# EAGLE board avocado-rev01 (EAGLE 9.4.0)
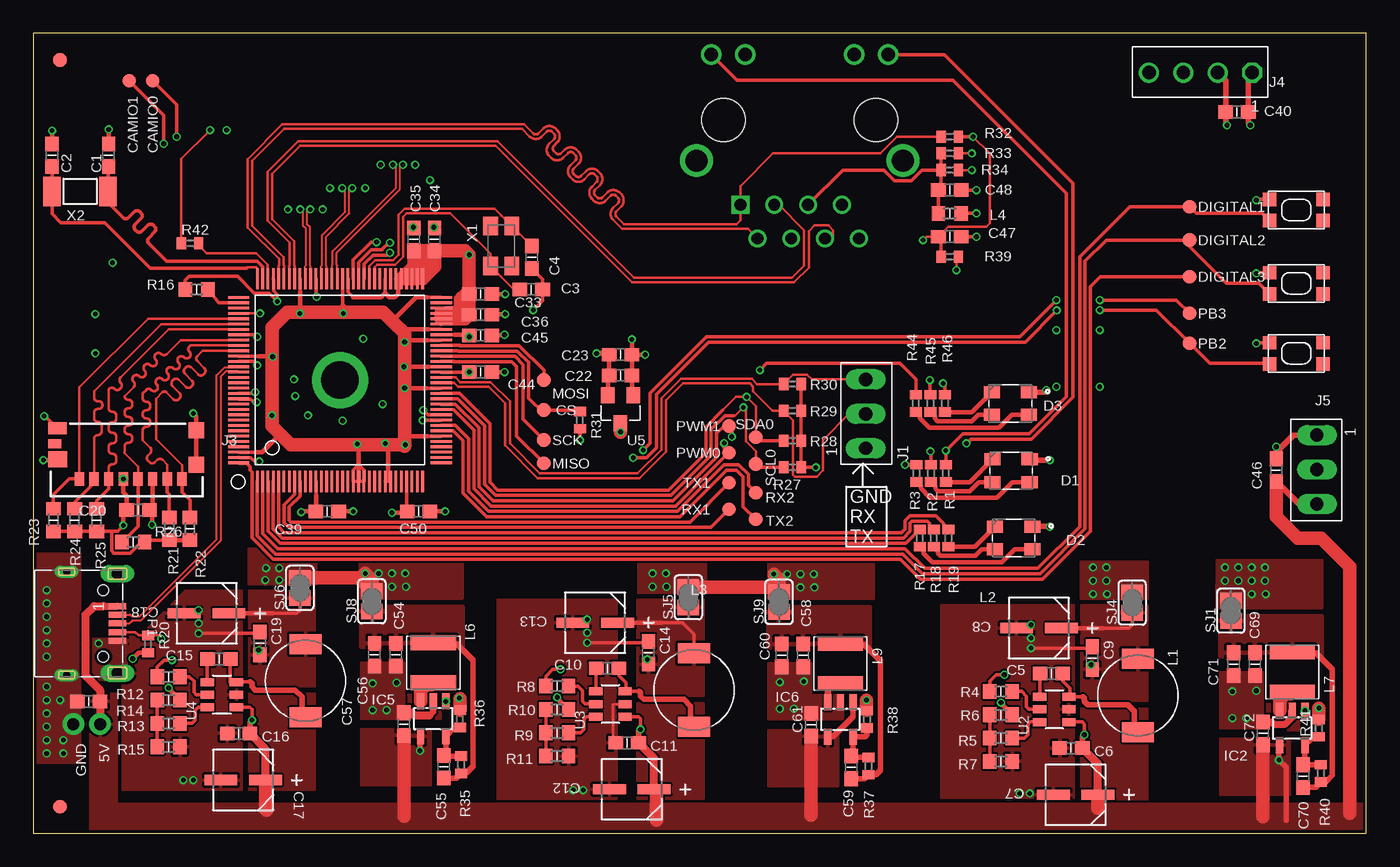
[diagram p5: board, top side]
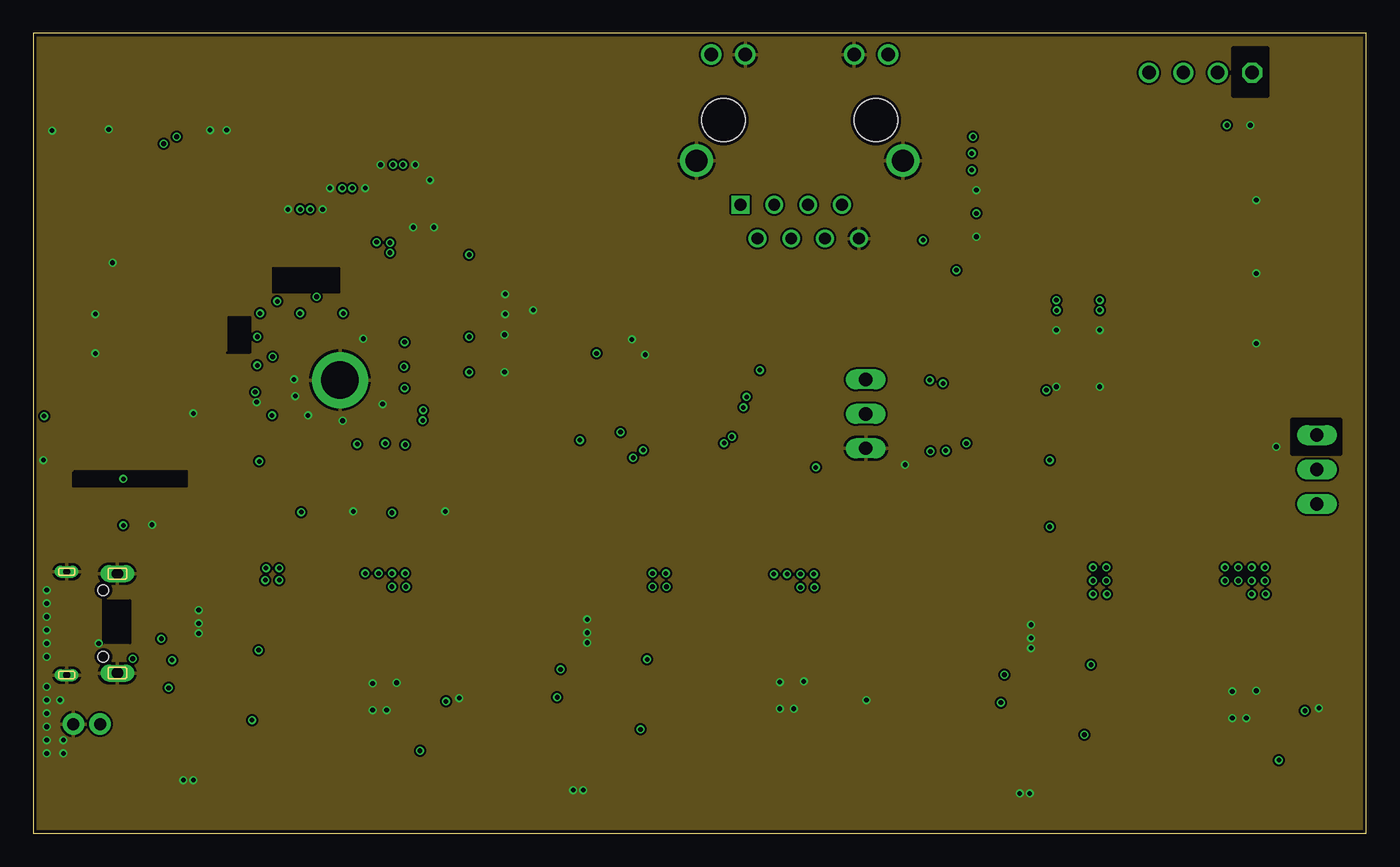
[diagram p6: board, inner layer GND]
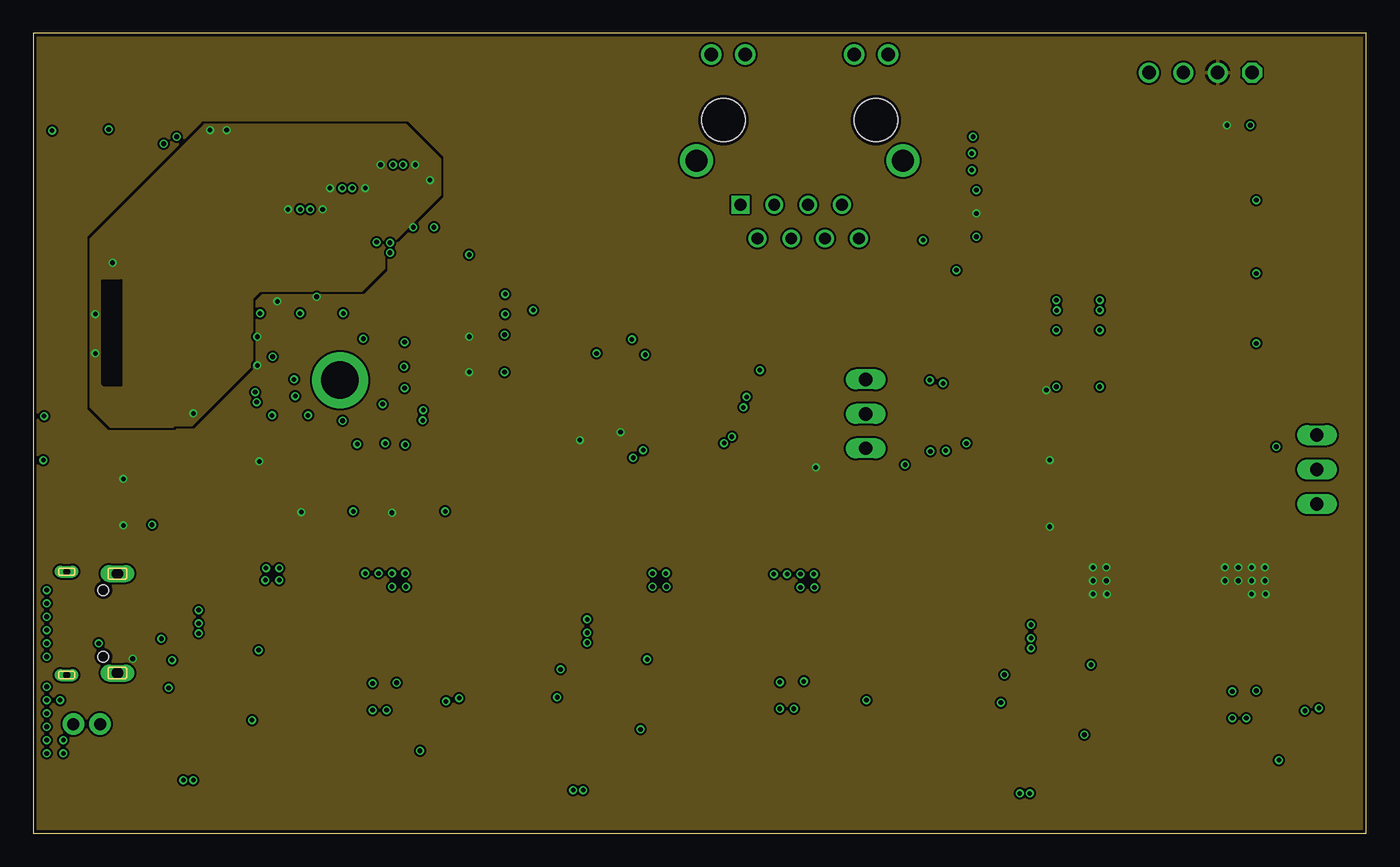
[diagram p7: board, inner layer 3V3]
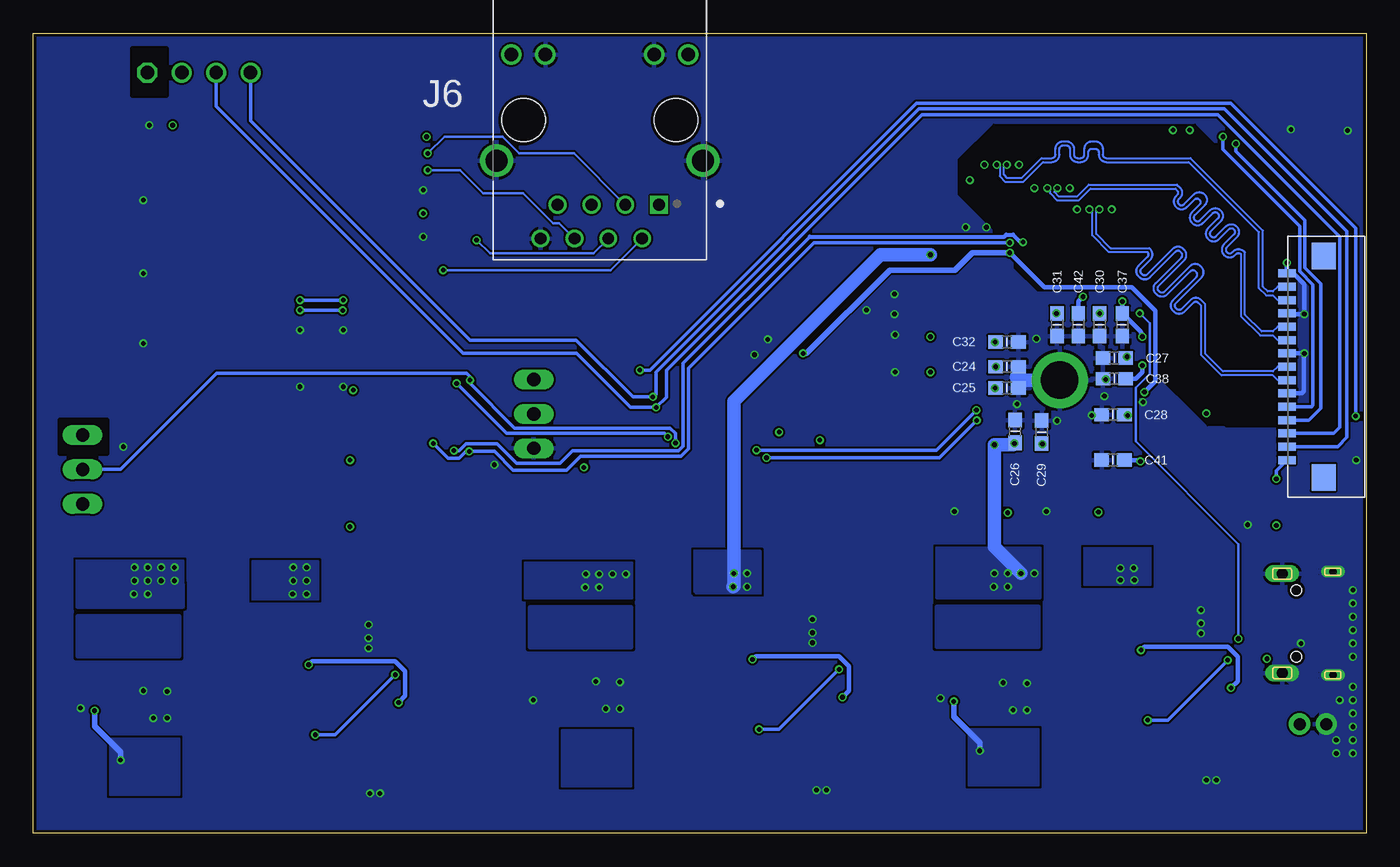
[diagram p8: board, bottom side, seen from below]

Size 100 x 60 mm. Coordinates in mm from the lower left corner, seen from the top.
Outline: 0,0 100,0 100,60 0,60 0,0
Copper layers (1+2*3+16): Top 0.018mm / dielectric 0.36mm / GND 0.035mm / dielectric 0.71mm / 3V3 0.035mm / dielectric 0.36mm / Bottom 0.018mm
Design rules "eC_4Layer_PClass6_BaseCopperO18-I35_eCDefault": minimum track width 0.15mm, minimum drill 0.35mm, track to track 0.15mm, track to pad 0.15mm, pad to pad 0.15mm, via to via 0.15mm, smd to smd 0mil, copper to edge 0.25mm, drill to drill 0.35mm, minimum pad ring 0.175mm, minimum via ring 0.125mm, stop-mask expansion 0mil, vias tented up to drill 0.45mm, thermal gap 0.2mm
Net classes: 0 default: width 0.2 mm, drill 0.35 mm, clearance 0.15 mm; 1 MIPI: width 0.15 mm, drill 0.35 mm, clearance 0.1 mm; 3 power: width 0.25 mm, drill 0.35 mm, clearance 0.15 mm

## Footprints (pad centres in the part's own frame; a part is rotated, then mirrored left to right if it is on the bottom)
PAD = drill 0.9 pad 1.6: P$1 0,0
C0603 = smd 1.1 x 1: 1 -0.85,0; 2 0.85,0
CAP4.3X6.1 = smd 2.464 x 0.762: 1 -1.676,0; 2 1.676,0
TEST_TESTPOINT = smd 1 x 1: 1 0,0
LED_LL-R3528RGBC-008-B = smd 1.2 x 0.9: 1 -1.4,-0.85; 2 1.4,-0.85; 3 1.4,0.85; 4 -1.4,0.85
FIDUCIAL_1MM = smd 1 x 1: 1 0,0
SOT23-5L = smd 0.55 x 1.2: 1 -0.95,-1.3; 2 0,-1.3; 3 0.95,-1.3; 4 0.95,1.3; 5 -0.95,1.3
HEADER-3 = drill 1 long: 1 -2.62,0.048; 2 -0.04,0.048; 3 2.54,0.048
MOLEX_0475710001 = smd 0.7 x 1: 1 3.55,1.415; 2 2.45,1.415; 3 1.35,1.415; 4 0.25,1.415; 5 -0.85,1.415; 6 -1.95,1.415; 7 -3.05,1.415; 8 -4.15,1.415 | smd 1.15 x 1.2: 9 -5.225,0.365; 10 -5.225,-2.225 | smd 1.4 x 0.9: 11 5.2,-2.375 | smd 1 x 0.7: 12 5.4,-1.225 | smd 1.45 x 1.2: 13 5.175,-0.075
HEADER-4 = drill 1 octagon: 1 -3.89,0.048 | drill 1: 2 -1.31,0.048; 3 1.27,0.048; 4 3.85,0.048
HANRUN_HR911105A = drill 0.89 square: 1 4.45,-6.35 | drill 0.89: 2 3.18,-8.89; 3 1.91,-6.35; 4 0.64,-8.89; 5 -0.63,-6.35; 6 -1.9,-8.89; 7 -3.17,-6.35; 8 -4.44,-8.89 | drill 1.02: 9 6.625,4.9; 10 4.085,4.9; 11 -4.085,4.9; 12 -6.625,4.9 | drill 1.63: 15 7.745,-3.05; 16 -7.745,-3.05 | hole 3.25: -5.715,0; 5.715,0
B82462A4153K = smd 1.5 x 2.4: P$1 -2.75,0; P$2 2.75,0
R0603 = smd 1 x 1.1: 1 -0.85,0; 2 0.85,0
ASPI-4030S-253675 = smd 1.1 x 3.4: P$1 -1.5,0; P$2 1.5,0
629105150521 = smd 0.45 x 1.3: 1 -1.3,1.05; 2 -0.65,1.05; 3 0,1.05; 4 0.65,1.05; 5 1.3,1.05 | drill 0.85 pad 1.2 long: SHELL -3.725,1.05; SHELL1 3.725,1.05 | drill 0.55 pad 0.9 long: SHELL2 -3.875,-2.75; SHELL3 3.875,-2.75 | hole 0.8: -2.5,0; 2.5,0
686115148922 = smd 0.6 x 1.3: 1 7,2.95; 2 6,2.95; 3 5,2.95; 4 4,2.95; 5 3,2.95; 6 2,2.95; 7 1,2.95; 8 0,2.95; 9 -1,2.95; 10 -2,2.95; 11 -3,2.95; 12 -4,2.95; 13 -5,2.95; 14 -6,2.95; 15 -7,2.95 | smd 2 x 1.8: SHLD1 -8.3,0.2; SHLD2 8.3,0.2
R0402 = smd 0.7 x 0.9: 1 -0.65,0; 2 0.65,0
SJ = smd 1.168 x 1.6: 1 -0.762,0; 2 0.762,0
KMR2 = smd 1 x 1: 1 2,0.8; 2 2,-0.8; 3 -2,0.8; 4 -2,-0.8
QFP-128 = smd 0.2 x 1.6: 1 -6.2,-7.6; 2 -5.8,-7.6; 3 -5.4,-7.6; 4 -5,-7.6; 5 -4.6,-7.6; 6 -4.2,-7.6; 7 -3.8,-7.6; 8 -3.4,-7.6; 9 -3,-7.6; 10 -2.6,-7.6; 11 -2.2,-7.6; 12 -1.8,-7.6; 13 -1.4,-7.6; 14 -1,-7.6; 15 -0.6,-7.6; 16 -0.2,-7.6; 17 0.2,-7.6; 18 0.6,-7.6; 19 1,-7.6; 20 1.4,-7.6; 21 1.8,-7.6; 22 2.2,-7.6; 23 2.6,-7.6; 24 3,-7.6; 25 3.4,-7.6; 26 3.8,-7.6; 27 4.2,-7.6; 28 4.6,-7.6; 29 5,-7.6; 30 5.4,-7.6; 31 5.8,-7.6; 32 6.2,-7.6; 65 6.2,7.6; 66 5.8,7.6; 67 5.4,7.6; 68 5,7.6; 69 4.6,7.6; 70 4.2,7.6; 71 3.8,7.6; 72 3.4,7.6; 73 3,7.6; 74 2.6,7.6; 75 2.2,7.6; 76 1.8,7.6; 77 1.4,7.6; 78 1,7.6; 79 0.6,7.6; 80 0.2,7.6; 81 -0.2,7.6; 82 -0.6,7.6; 83 -1,7.6; 84 -1.4,7.6; 85 -1.8,7.6; 86 -2.2,7.6; 87 -2.6,7.6; 88 -3,7.6; 89 -3.4,7.6; 90 -3.8,7.6; 91 -4.2,7.6; 92 -4.6,7.6; 93 -5,7.6; 94 -5.4,7.6; 95 -5.8,7.6; 96 -6.2,7.6 | smd 1.6 x 0.2: 33 7.6,-6.2; 34 7.6,-5.8; 35 7.6,-5.4; 36 7.6,-5; 37 7.6,-4.6; 38 7.6,-4.2; 39 7.6,-3.8; 40 7.6,-3.4; 41 7.6,-3; 42 7.6,-2.6; 43 7.6,-2.2; 44 7.6,-1.8; 45 7.6,-1.4; 46 7.6,-1; 47 7.6,-0.6; 48 7.6,-0.2; 49 7.6,0.2; 50 7.6,0.6; 51 7.6,1; 52 7.6,1.4; 53 7.6,1.8; 54 7.6,2.2; 55 7.6,2.6; 56 7.6,3; 57 7.6,3.4; 58 7.6,3.8; 59 7.6,4.2; 60 7.6,4.6; 61 7.6,5; 62 7.6,5.4; 63 7.6,5.8; 64 7.6,6.2; 97 -7.6,6.2; 98 -7.6,5.8; 99 -7.6,5.4; 100 -7.6,5; 101 -7.6,4.6; 102 -7.6,4.2; 103 -7.6,3.8; 104 -7.6,3.4; 105 -7.6,3; 106 -7.6,2.6; 107 -7.6,2.2; 108 -7.6,1.8; 109 -7.6,1.4; 110 -7.6,1; 111 -7.6,0.6; 112 -7.6,0.2; 113 -7.6,-0.2; 114 -7.6,-0.6; 115 -7.6,-1; 116 -7.6,-1.4; 117 -7.6,-1.8; 118 -7.6,-2.2; 119 -7.6,-2.6; 120 -7.6,-3; 121 -7.6,-3.4; 122 -7.6,-3.8; 123 -7.6,-4.2; 124 -7.6,-4.6; 125 -7.6,-5; 126 -7.6,-5.4; 127 -7.6,-5.8; 128 -7.6,-6.2 | drill 2.8: P$1 0,0
TSOT26 = smd 0.6 x 1: 1 -0.95,-1.099; 2 0,-1.099; 3 0.95,-1.099; 4 0.95,1.099; 5 0,1.099; 6 -0.95,1.099
SOT-23 = smd 1.016 x 1.2: 1 -0.95,-1.06; 2 0.95,-1.06; 3 0,1.06
3.2X2-4 = smd 1.4 x 1.1: P$1 -1.5,0.8; P$2 1.5,0.8; P$3 1.5,-0.8; P$4 -1.5,-0.8
XTAL-5X1.9 = smd 1.3 x 2.2: P$1 -2.1,0; P$2 2.1,0

## Placement (x,y rotation side)
5V  PADTH  [PAD]  5,8.2 180 top
C1  [C0603]  5.65,50.85 90 top
C2  [C0603]  1.4,50.85 90 top
C3  [C0603]  37.35,40.8 0 top
C4  [C0603]  37.4,43.2 270 top
C5  1u  [C0603]  76.38,11.98 0 top
C6  100n  [C0603]  77.85,6.39 180 top
C7  22u  [CAP4.3X6.1]  78.2,2.9 180 top
C8  22u  [CAP4.3X6.1]  75.45,15.4 180 top
C9  100n  [C0603]  79.45,13.15 90 top
C10  1u  [C0603]  43.08,12.38 0 top
C11  100n  [C0603]  44.55,6.79 180 top
C12  22u  [CAP4.3X6.1]  44.9,3.3 180 top
C13  22u  [CAP4.3X6.1]  42.15,15.8 180 top
C14  100n  [C0603]  46.15,13.55 90 top
C15  1u  [C0603]  13.93,13.08 0 top
C16  100n  [C0603]  15.4,7.49 180 top
C17  22u  [CAP4.3X6.1]  15.75,4 180 top
C18  22u  [CAP4.3X6.1]  13,16.5 180 top
C19  100n  [C0603]  17,14.25 90 top
C20  10u  [C0603]  7.85,24.25 0 top
C21  10u  [C0603]  4.15,9.9 180 top
C22  10u  [C0603]  44.05,34.35 0 top
C23  10u  [C0603]  44.05,35.9 0 top
C24  10u  [C0603]  26.95,35 0 bottom
C25  10u  [C0603]  26.95,33.4 0 bottom
C26  10u  [C0603]  26.35,30.15 90 bottom
C27  10u  [C0603]  18.9,35.65 180 bottom
C28  10u  [C0603]  19,31.4 180 bottom
C29  10u  [C0603]  24.35,30.1 90 bottom
C30  10u  [C0603]  20,38.15 270 bottom
C31  10u  [C0603]  23.2,38.15 270 bottom
C32  10u  [C0603]  26.95,36.85 0 bottom
C33  10u  [C0603]  33.55,40.45 0 top
C34  10u  [C0603]  30.1,44.55 90 top
C35  10u  [C0603]  28.55,44.55 90 top
C36  10u  [C0603]  33.55,38.9 0 top
C37  10u  [C0603]  18.3,38.15 270 bottom
C38  10u  [C0603]  18.9,34.1 180 bottom
C39  10u  [C0603]  22.05,24.15 0 top
C40  10u  [C0603]  90.3,54.1 180 top
C41  10u  [C0603]  19,28 180 bottom
C42  10u  [C0603]  21.6,38.15 270 bottom
C44  10u  [C0603]  33.55,34.6 0 top
C45  10u  [C0603]  33.55,37.35 0 top
C46  10u  [C0603]  93.25,27.25 270 top
C47  10u  [C0603]  68.75,44.75 0 top
C48  10u  [C0603]  68.75,48.25 0 top
C50  10u  [C0603]  28.9,24.15 0 top
C54  4u7  [C0603]  27.2,13.4 90 top
C55  47p  [C0603]  30.8,5 270 top
C56  10u  [C0603]  25.6,13.4 90 top
C57  10u  [C0603]  27.8,8.2 90 top
C58  4u7  [C0603]  57.75,13.35 90 top
C59  47p  [C0603]  61.35,4.95 270 top
C60  10u  [C0603]  56.15,13.35 90 top
C61  10u  [C0603]  58.35,8.15 90 top
C69  4u7  [C0603]  91.65,12.7 90 top
C70  47p  [C0603]  95.25,4.3 270 top
C71  10u  [C0603]  90.05,12.7 90 top
C72  10u  [C0603]  92.25,7.5 90 top
CAMIO0  TEST_TESTPOINT  [TEST_TESTPOINT]  8.95,56.45 270 top
CAMIO1  TEST_TESTPOINT  [TEST_TESTPOINT]  7.2,56.45 270 top
CS  TEST_TESTPOINT  [TEST_TESTPOINT]  38.3,31.75 0 top
D1  LL-R3528RGBC-008-B  [LED_LL-R3528RGBC-008-B]  73.35,27.2 180 top
D2  LL-R3528RGBC-008-B  [LED_LL-R3528RGBC-008-B]  73.55,22.15 180 top
D3  LL-R3528RGBC-008-B  [LED_LL-R3528RGBC-008-B]  73.3,32.25 180 top
DIGITAL1  TEST_TESTPOINT  [TEST_TESTPOINT]  86.75,47 0 top
DIGITAL2  TEST_TESTPOINT  [TEST_TESTPOINT]  86.75,44.5 0 top
DIGITAL3  TEST_TESTPOINT  [TEST_TESTPOINT]  86.75,41.75 0 top
FID1  FIDUCIAL  [FIDUCIAL_1MM]  2,58 0 top
FID2  FIDUCIAL  [FIDUCIAL_1MM]  2,2 0 top
GND  PADTH  [PAD]  3,8.2 180 top
IC2  3V#  [SOT23-5L]  94.45,7.9 180 top
IC5  3V#  [SOT23-5L]  30,8.6 180 top
IC6  [SOT23-5L]  60.55,8.55 180 top
J1  CONNECTOR-3HEADER3  [HEADER-3]  62.5,31.5 90 top
J3  0475710001  [MOLEX_0475710001]  7,28 180 top
J4  CONNECTOR-4HEADER4  [HEADER-4]  87.55,57.1 180 top
J5  CONNECTOR-3HEADER3  [HEADER-3]  96.25,27.25 270 top
J6  HR911105A  [HANRUN_HR911105A]  57.5,53.5 0 bottom
L1  CALC  [B82462A4153K]  82.87,10.34 90 top
L2  CALC  [B82462A4153K]  49.57,10.74 90 top
L3  CALC  [B82462A4153K]  20.42,11.44 90 top
L4  10uH(NC)  [R0603]  68.75,46.5 180 top
L6  2.2uH-DCR<0.1R-1.5A  [ASPI-4030S-253675]  30,12.8 90 top
L7  2.2uH-DCR<0.1R-1.5A  [ASPI-4030S-253675]  94.45,12.1 90 top
L9  2.2uH-DCR<0.1R-1.5A  [ASPI-4030S-253675]  60.55,12.75 90 top
MISO  TEST_TESTPOINT  [TEST_TESTPOINT]  38.3,27.75 0 top
MOSI  TEST_TESTPOINT  [TEST_TESTPOINT]  38.3,34 0 top
P1  USB629105150521  [629105150521]  5.25,15.75 270 top
P2  CONNECTOR-15686115148922  [686115148922]  3,35 90 bottom
PB2  TEST_TESTPOINT  [TEST_TESTPOINT]  86.75,36.75 0 top
PB3  TEST_TESTPOINT  [TEST_TESTPOINT]  86.75,39 0 top
PWM0  TEST_TESTPOINT  [TEST_TESTPOINT]  52.2,28.55 180 top
PWM1  TEST_TESTPOINT  [TEST_TESTPOINT]  52.2,30.55 180 top
R1  [R0402]  68.45,27 270 top
R2  [R0402]  67.35,27 270 top
R3  [R0402]  66.25,27 270 top
R4  100k  [R0603]  72.6,10.64 180 top
R5  59k  [R0603]  72.6,7.14 0 top
R6  CALC  [R0603]  72.6,8.89 180 top
R7  CALC  [R0603]  72.6,5.39 0 top
R8  100k  [R0603]  39.3,11.04 180 top
R9  59k  [R0603]  39.3,7.54 0 top
R10  CALC  [R0603]  39.3,9.29 180 top
R11  CALC  [R0603]  39.3,5.79 0 top
R12  100k  [R0603]  10.15,11.74 180 top
R13  59k  [R0603]  10.15,8.24 0 top
R14  CALC  [R0603]  10.15,9.99 180 top
R15  CALC  [R0603]  10.15,6.49 0 top
R16  0  [R0603]  12.25,40.8 180 top
R17  [R0402]  66.5,22.15 270 top
R18  [R0402]  67.55,22.15 270 top
R19  [R0402]  68.65,22.15 270 top
R20  10k  [R0402]  8.6,14.2 90 top
R21  47k  [R0603]  10.2,22.85 270 top
R22  47k  [R0603]  11.75,22.85 270 top
R23  47k  [R0603]  1.5,23.5 270 top
R24  47k  [R0603]  3.1,23.5 270 top
R25  47k  [R0603]  4.75,23.5 270 top
R26  47k  [R0603]  7.5,21.85 0 top
R27  2k  [R0402]  56.95,27.45 180 top
R28  2k  [R0402]  56.95,29.45 180 top
R29  NC2k  [R0402]  56.95,31.7 180 top
R30  NC2k  [R0402]  56.95,33.7 180 top
R31  10k  [R0402]  41,31 90 top
R32  51(NC)  [R0402]  68.75,52.25 0 top
R33  51(NC)  [R0402]  68.75,51 180 top
R34  51(NC)  [R0402]  68.75,49.75 180 top
R35  100K-1%  [R0402]  32.1,5.15 270 top
R36  100K-1%  [R0402]  32,8.6 90 top
R37  200K-1%  [R0402]  62.65,5.05 270 top
R38  100K-1%  [R0402]  62.55,8.55 90 top
R39  51(NC)  [R0402]  68.75,43.25 180 top
R40  470K-1%  [R0402]  96.6,4.5 270 top
R41  100K-1%  [R0402]  96.45,7.9 90 top
R42  6K-1%  [R0402]  11.75,44.25 0 top
R44  [R0402]  66.2,32.25 270 top
R45  [R0402]  67.3,32.25 270 top
R46  [R0402]  68.4,32.25 270 top
RX1  TEST_TESTPOINT  [TEST_TESTPOINT]  52.2,24.3 180 top
RX2  TEST_TESTPOINT  [TEST_TESTPOINT]  54.2,25.55 180 top
SCK  TEST_TESTPOINT  [TEST_TESTPOINT]  38.3,29.5 0 top
SCL0  TEST_TESTPOINT  [TEST_TESTPOINT]  54.2,27.7 180 top
SDA0  TEST_TESTPOINT  [TEST_TESTPOINT]  54.2,29.7 180 top
SJ1  [SJ]  89.85,16.7 90 top
SJ4  [SJ]  82.45,17.3 90 top
SJ5  [SJ]  49.15,17.7 90 top
SJ6  [SJ]  20,18.4 90 top
SJ8  [SJ]  25.4,17.4 90 top
SJ9  [SJ]  55.95,17.35 90 top
SW1  SPST_TACT-KMR2  [KMR2]  94.75,41.25 180 top
SW2  SPST_TACT-KMR2  [KMR2]  94.75,36 180 top
SW3  SPST_TACT-KMR2  [KMR2]  94.75,46.75 180 top
TX1  TEST_TESTPOINT  [TEST_TESTPOINT]  52.2,26.3 180 top
TX2  TEST_TESTPOINT  [TEST_TESTPOINT]  54.2,23.55 270 top
U1  V3S  [QFP-128]  23,34 0 top
U2  AP65111A  [TSOT26]  76.6,9.3 90 top
U3  AP65111A  [TSOT26]  43.3,9.7 90 top
U4  AP65111A  [TSOT26]  14.15,10.4 90 top
U5  PMIC-LDO-XC6206P302MR(SOT23)  [SOT-23]  44.05,31.8 180 top
X1  [3.2X2-4]  35.1,44.05 90 top
X2  [XTAL-5X1.9]  3.5,48.15 0 top

## Tracks (layer width: path | path; a pad name or v marks a point on that pad's centre or on a via)
1V2  (via drill 0.35)
  Top 0.25: U1.80 23.2,39.6 | U1.64 29.55,40.2 | U1.56 29.6,37 27.95,37 | 29.65,35 U1.51 | U1.47 29.5,33.4 | 29.6,29.8 U1.38 | U1.126 16.65,28.6 | 16.9,35.8 U1.108 | U1.88 20,40.65 | 27.85,33.3 v27.85,33.4 27.85,32.75 | C24.1 27.85,35.05 | v23.25,39 23.35,39.1 23.7,39.1 | 17.9,35.8 17.9,35.85 | C30.1 19.95,39.05 19.95,39.1 | v24.3,29.2 24.35,29.15 24.6,29.15 | U1.26 U1.25 26.6,26.6 | 29.64,37.8 U1.58 | U1.19 U1.21 24.8,27.25 24.4,27.65 24,27.25 U1.19
  Top 0.35: 26.6,26.6 26.6,29.15 | U1.20 24.4,27.65 24.4,28.95 24.6,29.15 | 16.65,28.6 17.15,28.6 18.5,29.95 | 20,40.65 20,39.15 19.95,39.1 | 23.2,39.6 23.7,39.1 | 29.55,40.2 28.7,40.2 26.93,38.42 | 27.95,37 27.85,36.9 | 29.65,35 27.9,35 27.85,35.05 | 29.5,33.4 27.95,33.4 27.85,33.3 | 29.6,29.8 27.95,29.8 27.85,29.9 | v27.85,36.85 28,37 29.6,37 | 27.85,37.5 28.15,37.8 29.64,37.8 | v17.95,35.75 17.9,35.8 16.9,35.8
  Top 1.016: v24.9,19.5 25.4,19 SJ8.2 24.4,19.16 SJ6.2 | v27.9,29.15 26.6,29.15 24.6,29.15 19.3,29.15 18.5,29.95 17.9,30.55 v17.9,31.35 17.9,35.85 17.9,37.95 19.05,39.1 19.95,39.1 23.7,39.1 26.25,39.1 26.93,38.42 27.85,37.5 27.85,36.9 v27.85,36.85 27.85,35.05 v27.85,33.4 | 27.85,29.1 27.85,29.9 27.85,32.75 27.85,33.3 | 27.85,29.1 27.85,29.05 27.8,29.1 27.85,29.1
  Bottom 0.25: C31.1 v23.25,39 | C27.1 v17.95,35.75 | C28.1 17.95,31.4 v17.9,31.35 | C29.1 v24.3,29.2 | C26.1 26.5,29.15 | C32.1 v27.85,36.85 | C25.1 v27.85,33.4
  Bottom 1.016: v25.9,19.5 27.9,21.5 v27.9,29.15 26.5,29.15 v26.4,29.25
  other vias: 27.95,18.5 26.9,18.5 26.9,19.5 27.9,19.5 18.45,19.9 17.45,19.9 17.4,19 18.45,19 27.8,35 20,39
  pour Top (no thermals): 21.2,18.65 16.15,18.65 16.15,21.4 21.2,21.4
  pour Top (no thermals): 24.5,17.6 32.2,17.6 32.25,17.65 32.25,21.45 24.45,21.45 24.45,17.65
  pour Bottom (no thermals): 21.2,18.65 16.15,18.65 16.15,21.4 21.2,21.4
  pour Bottom (no thermals): 24.5,17.6 32.2,17.6 32.25,17.65 32.25,21.45 24.45,21.45 24.45,17.65
1V8  (via drill 0.35)
  Top 0.25: U1.79 23.6,40.6 24,40.2 | U1.72 26.4,40.5 | U1.61 U1.62 | U1.59 U1.60 | U1.70 U1.69 | U1.68 U1.67
  Top 0.35: U1.69 27.23,41.6 27.23,41.58 27.35,41.45 27.35,40.45 27.1,40.2 26.7,40.2 26.4,40.5 26.1,40.2 24,40.2
  Top 1.016: v55.55,19.45 55.95,19.05 SJ9.2 55.6,18.46 SJ5.2 | U1.60 U1.61 | C33.1 v32.7,43.4 32.4,43.7 C34.1 | C33.1 C36.1 32.4,38.6 U1.60 | 29.45,43.7 C35.1 28.55,42.55 U1.69 U1.67 U1.66 28.8,41.7 | 29.45,43.7 C34.1 | C33.1 32.45,40.45 32.06,40.06 32.06,39.43 31.67,39.04 31.04,39.04 U1.60 | 28.8,41.7 28.8,42.4 C34.1 | 28.8,41.7 29.45,42.35 29.45,43.7 | C34.1 30.1,42.5 U1.65
  Bottom 1.016: v32.7,43.4 36.45,43.4 47.45,32.4 47.45,18.55 v47.5,18.5
  other vias: 58.55,19.45 58.6,18.45 57.55,18.45 57.55,19.45 56.55,19.45 47.45,19.5 46.45,18.5 46.45,19.5
  pour Top (no thermals): 63.1,17.6 63.1,20.35 55.1,20.35 55.1,17.6
  pour Top (no thermals): 50.3,18 45.4,18 45.4,21.15 45.45,21.2 50.4,21.2 50.45,21.15 50.45,18.15
  pour Bottom (no thermals): 50.3,18 45.4,18 45.4,21.15 45.45,21.2 50.4,21.2 50.45,21.15 50.45,18.15
  pour Bottom (no thermals): 63.1,17.6 63.1,20.35 55.1,20.35 55.1,17.6
3V  (via drill 0.35)
  Top 0.25: U1.115 16.55,33 | U1.76 24.82,41.62 24.82,42.7 25.5,43.38 26.57,43.38 v26.75,43.55
  Top 0.35: U5.2 43.1,34.25 C22.1 C23.1 | 16.55,33 v16.65,33.1
  Top 0.406: v42.25,36 43.1,36 C23.1
  Bottom 0.35: v26.75,43.55 24.15,40.95 17.57,40.95 15.82,39.2 15.82,33.92 v16.65,33.1
  Bottom 0.406: v26.75,43.55 29.55,43.55 30.85,42.25 35.75,42.25 42,36 v42.25,36
3V3  (via drill 0.35)
  Top 0.25: U1.57 31.6,37.4 | U1.12 21.2,25.35 | U1.127 15.43,28.18 16.31,28.18 16.59,27.9 v16.95,27.9 | U1.109 16.5,35.4 v16.8,35.1 | U1.104 16.65,37.4 | U1.85 21.2,40.3 | U1.50 C44.1 | v58.7,27.45 R27.1 R28.1 R29.1 R30.1 | R16.2 11.4,41.49 11.69,41.77 15.34,41.77 16.59,40.52 17.68,40.52 v18.3,39.9 18.3,40.41 18.02,40.69 18.02,41.58 U1.93 | C45.1 v32.7,37.25 | U1.29 28,24.2 | R31.1 v41,29.5 | L4.1 v70.75,46.5 | R23.2 R24.2 R25.2 5.75,22.65 | R21.2 8.5,22 R26.2 8.09,21.85 7.26,21.02 6.04,21.02 5.88,21.19 5.88,22.52 5.75,22.65 | v6.75,23.1 6.33,22.68 6.04,22.68 6.01,22.65 5.75,22.65
  Top 0.35: J3.4 6.75,25.59 7,25.34 C20.1 6.75,24 v6.75,23.1 | R22.2 R21.2 | R20.1 7.9,13.55 v7.45,13.1 | 16.65,37.4 v16.8,37.25 | 21.2,40.3 v21.25,40.25 | 21.2,25.35 C39.1 20.15,24.15 v20.1,24.1 | C50.1 28,24.2 27.85,24.05 v26.9,24.05 | 31.6,37.4 32.65,37.4 C45.1
  Top 0.406: J4.2 89.45,56.46 C40.2 89.45,53.2 v89.55,53.1 | D2.1 75,23.05 76.2,23.05 v76.25,23 | D3.1 75.85,33.1 v76,33.25 | D1.1 74.8,28 v76.25,28
  Top 1.016: U5.3 v44.05,30.1
  Bottom 0.25: P2.15 6.75,27.2 J3.4
  Bottom 0.35: v18.3,39.9 C37.1 16.93,37.62 16.93,37.55 16.8,37.43 v16.8,37.25 | v16.8,35.1 16.8,34.6 17.3,34.1 C38.1 | v16.95,27.9 16.95,28 C41.1 | v21.25,40.25 21.6,39.9 C42.1
  other vias: 79.5,19.95 80.5,19.95 80.5,18.95 79.5,18.95 79.5,17.95 80.55,17.95 89.4,18.95 89.4,19.95 90.4,19.95 90.4,18.95 91.4,19.95 92.4,18.95 91.4,18.95 92.45,17.95 92.4,19.95 91.4,17.95 32.7,34.6 6.75,26.59
  pour 3V3 (rank 6): 0.05,59.95 100,59.95 100,0 0.05,0
  pour Top (no thermals): 83.6,17.55 78.6,17.55 78.6,20.4 83.6,20.4
  pour Top (no thermals): 88.8,16.9 96.7,16.9 96.75,16.95 96.75,20.5 88.77,20.5 88.7,17
  pour Bottom (no thermals): 83.6,17.55 78.6,17.55 78.6,20.4 83.6,20.4
  pour Bottom (no thermals): 88.8,16.9 96.7,16.9 96.75,16.95 96.75,20.5 88.77,20.5 88.7,17
CAM_IO0  (via drill 0.35)
  Top 0.25: CAMIO0.1 10.75,54.65 v10.75,52.25
  Bottom 0.25: P2.11 4.1,32 4,32.1 4,41.15 5,42.15 5,45.55 10.75,51.3 v10.75,52.25
CAM_IO1  (via drill 0.35)
  Top 0.25: v9.78,51.72 9.78,53.87 CAMIO1.1
  Bottom 0.25: P2.12 4.3,31 3.4,31.9 3.4,41.21 4.6,42.41 4.6,45.97 9.78,51.15 v9.78,51.72
CK_N  (via drill 0.35)
  Top 0.15: v20.77,46.8 20.55,46.8 20.55,45.66 20.75,45.46 20.75,42.6 20.8,42.55 U1.86
  Bottom 0.15: 12.4,39.59 12.4,35.89 10.86,34.35 7,34.35 6.65,34 P2.9 | v20.77,46.8 20.55,46.8 20.55,44.84 19.31,43.6 16.41,43.6 | 12.4,39.59 | 12.4,39.59 12.6,39.78 arc-90 12.97,39.78 13.63,39.12 arc90 14.43,39.12 14.49,39.18 arc90 14.49,39.98 12.76,41.72 arc-90 12.76,42.09 12.82,42.15 arc-90 13.19,42.15 14.93,40.41 arc90 15.72,40.41 15.78,40.48 arc90 15.78,41.27 13.87,43.18 arc-90 13.87,43.56 13.94,43.62 arc-90 14.31,43.62 16.22,41.71 arc90 17.01,41.71 17.08,41.77 arc90 17.08,42.56 16.41,43.23 arc-90 16.41,43.6 | 16.41,43.6
CK_P  (via drill 0.35)
  Top 0.15: v20.02,46.8 20.25,46.8 20.25,45.54 20.45,45.34 20.45,42.6 20.4,42.55 U1.87
  Bottom 0.15: P2.8 6.65,35 7,34.65 10.74,34.65 12.1,36.01 12.1,39.71 12.38,40 arc-90 13.18,40 13.85,39.33 arc90 14.22,39.33 14.28,39.4 arc90 14.28,39.77 12.37,41.68 arc-90 12.37,42.48 12.43,42.54 arc-90 13.22,42.54 15.14,40.62 arc90 15.51,40.62 15.57,40.69 arc90 15.57,41.06 13.66,42.97 arc-90 13.66,43.77 13.72,43.83 arc-90 14.52,43.83 16.43,41.92 arc90 16.8,41.92 16.86,41.98 arc90 16.86,42.35 16.2,43.02 arc-90 16.2,43.81 16.29,43.9 19.19,43.9 20.25,44.96 20.25,46.8 v20.02,46.8
CS
  Top 0.25: U1.54 31.84,36.2 31.87,36.17 36.29,36.17 37.15,35.32 37.15,32.65 38.3,31.5 CS.1 40.9,31.75 R31.2
D0_N  (via drill 0.35)
  Top 0.15: U1.82 22.4,42.6 22.45,42.65 22.45,43.66 27.2,48.41 27.2,50.15 v26.98,50.15
  Bottom 0.15: P2.2 6.65,41 7,40.65 7.39,40.65 7.75,41.01 7.75,45.21 13.19,50.65 19.5,50.65 arc90 19.76,50.91 19.76,51.33 arc-90 20.32,51.89 20.58,51.89 arc-90 21.14,51.33 21.14,50.91 arc90 21.41,50.65 21.66,50.65 arc90 21.93,50.91 21.93,51.33 arc-90 22.49,51.89 22.75,51.89 arc-90 23.31,51.33 23.31,50.91 arc90 23.57,50.65 24.36,50.65 25.86,49.15 26.94,49.15 27.2,49.41 27.2,50.15 v26.98,50.15
D0_P  (via drill 0.35)
  Top 0.15: U1.81 22.8,42.6 22.75,42.65 22.75,43.54 27.5,48.29 27.5,50.15 v27.73,50.15
  Bottom 0.15: P2.3 6.65,40 7,40.35 7.51,40.35 8.05,40.89 8.05,45.09 13.31,50.35 19.5,50.35 arc90 20.06,50.91 20.06,51.08 arc-90 20.32,51.34 20.58,51.34 arc-90 20.84,51.08 20.84,50.91 arc90 21.41,50.35 21.66,50.35 arc90 22.23,50.91 22.23,51.33 arc-90 22.49,51.59 22.75,51.59 arc-90 23.01,51.33 23.01,50.91 arc90 23.57,50.35 24.24,50.35 25.74,48.85 27.06,48.85 27.5,49.29 27.5,50.15 v27.73,50.15
D1_N  (via drill 0.35)
  Top 0.15: U1.84 21.6,42.55 21.65,42.6 21.65,44.86 23.4,46.61 23.4,48.4 v23.18,48.4
  Bottom 0.15: P2.5 6.65,38 7,37.65 7.84,37.65 9.1,38.91 9.1,43.56 9.19,43.65 arc-90 9.98,43.65 10.06,43.57 arc90 10.44,43.57 10.45,43.59 arc90 10.45,43.96 9.71,44.7 arc-90 9.71,45.5 9.73,45.52 arc-90 10.52,45.52 11.27,44.77 arc90 11.64,44.77 11.66,44.79 arc90 11.66,45.16 10.91,45.91 arc-90 10.91,46.7 10.93,46.72 arc-90 11.72,46.72 12.47,45.97 arc90 12.84,45.97 12.86,45.99 arc90 12.86,46.36 12.11,47.11 arc-90 12.11,47.9 12.13,47.92 arc-90 12.93,47.92 13.67,47.18 arc90 14.04,47.18 14.06,47.2 arc90 14.06,47.57 13.98,47.65 arc-90 13.98,48.44 14.19,48.65 | v23.18,48.4 23.4,48.4 23.4,48.11 23.04,47.75 21.71,47.75 20.81,48.65 14.19,48.65 | 14.19,48.65
D1_P  (via drill 0.35)
  Top 0.15: v23.93,48.4 23.7,48.4 23.7,46.49 21.95,44.74 21.95,42.6 22,42.55 U1.83
  Bottom 0.15: P2.6 6.65,37 7,37.35 7.96,37.35 9.4,38.79 9.4,43.44 | v23.93,48.4 23.7,48.4 23.7,47.99 23.16,47.45 21.59,47.45 20.69,48.35 14.31,48.35 14.19,48.23 arc90 14.19,47.86 14.27,47.78 arc-90 14.27,46.98 14.26,46.97 arc-90 13.46,46.97 12.89,47.53 arc90 12.52,47.53 12.5,47.52 arc90 12.5,47.15 13.07,46.58 arc-90 13.07,45.78 13.05,45.76 arc-90 12.26,45.76 11.51,46.51 arc90 11.14,46.51 11.12,46.49 arc90 11.12,46.12 11.87,45.37 arc-90 11.87,44.58 11.85,44.56 arc-90 11.05,44.56 10.31,45.3 arc90 9.94,45.3 9.92,45.29 arc90 9.92,44.92 10.67,44.17 arc-90 10.67,43.38 10.65,43.36 arc-90 9.85,43.36 9.77,43.44 arc90 9.4,43.44 | 9.4,43.44
ETH_RX_N  (via drill 0.35)
  Top 0.2: U1.89 19.6,42.58 19.57,42.6 19.57,44.42 17.93,46.07 17.93,49.48 20.02,51.58 34.68,51.58 44.93,41.33 57.07,41.33 58.17,42.43 58.17,45.17 58.6,45.6 59.65,45.6 60,45.25 60,44.75 59.86,44.61 J6.6 | R34.1 v70.4,49.75
  Bottom 0.2: J6.6 60.54,45.75 61,45.75 63.25,48 66.25,48 68,49.75 v70.4,49.75
ETH_RX_P  (via drill 0.35)
  Top 0.2: U1.90 19.2,42.58 19.23,42.6 19.23,44.28 17.57,45.93 17.57,49.62 19.88,51.92 34.82,51.92 45.07,41.67 56.93,41.67 57.83,42.57 57.83,45.25 55.92,47.15 J6.3 | R33.1 v70.4,51
  Bottom 0.2: J6.3 59.44,51 63.55,51 64.8,52.25 69.15,52.25 v70.4,51
ETH_TX_N  (via drill 0.35)
  Top 0.2: U1.91 18.8,42.58 18.77,42.6 18.77,43.22 16.43,45.57 16.43,50.43 18.82,52.83 36.68,52.83 37.25,52.26 arc90 38.15,52.26 38.51,52.62 arc-90 38.92,52.62 39.06,52.47 arc-90 39.06,52.07 38.7,51.7 arc90 38.7,50.8 38.85,50.66 arc90 39.75,50.66 40.11,51.02 arc-90 40.52,51.02 40.66,50.87 arc-90 40.66,50.47 40.3,50.1 arc90 40.3,49.2 40.45,49.06 arc90 41.35,49.06 41.71,49.42 arc-90 42.12,49.42 42.27,49.27 arc-90 42.27,48.87 41.9,48.5 arc90 41.9,47.6 42.05,47.45 arc90 42.95,47.45 43.31,47.82 arc-90 43.72,47.82 43.87,47.67 arc-90 43.87,47.27 43.5,46.9 arc90 43.5,46 44.18,45.33 53.6,45.33 J6.2 | v69.25,42.25 69.25,43.1 R39.1
  Bottom 0.2: J6.2 56.68,42.25 v69.25,42.25
ETH_TX_P
  Top 0.2: U1.92 18.4,42.58 18.43,42.6 18.43,43.08 16.07,45.43 16.07,50.57 18.68,53.17 36.82,53.17 37.49,52.5 arc90 37.9,52.5 38.26,52.87 arc-90 39.17,52.87 39.31,52.72 arc-90 39.31,51.82 39.06,51.57 arc90 39.06,51.16 39.2,51.01 arc90 39.61,51.01 39.87,51.27 arc-90 40.77,51.27 40.91,51.12 arc-90 40.91,50.22 40.55,49.86 arc90 40.55,49.45 40.69,49.3 arc90 41.1,49.3 41.47,49.67 arc-90 42.37,49.67 42.51,49.52 arc-90 42.51,48.62 42.15,48.26 arc90 42.15,47.85 42.3,47.7 arc90 42.7,47.7 43.06,48.07 arc-90 43.97,48.07 44.11,47.92 arc-90 44.11,47.02 43.75,46.66 arc90 43.75,46.25 44.32,45.67 52.75,45.67 53.05,45.98 J6.1 53.05,48.55 55.5,51 63.55,51 64.8,52.25 R32.1
GND  (via drill 0.35)
  Top 0.2: R42.1 11.1,50.6 v13.25,52.75 | C11.2 43.5,6.99 43.5,9.65 43.55,9.7 U3.2
  Top 0.25: C9.2 79.35,13.9 77.95,13.9 77.94,13.89 v74.85,13.89 | C14.2 46.05,14.3 44.65,14.3 44.64,14.29 v41.55,14.29 | C19.2 16.9,15 15.5,15 15.49,14.99 v12.4,14.99 | U1.116 15.43,32.58 16.31,32.58 16.54,32.35 v16.75,32.35 | v31.95,10.15 32,10.1 | C47.2 v70.75,44.75 | C48.2 v70.75,48.25 | SW1.2 91.8,42.05 v91.75,42 | SW2.2 91.8,36.8 v91.75,36.75 | v91.75,47.5 91.8,47.55 SW3.2 | C4.2 38.2,41.55 C3.2 38.2,39.95 v37.5,39.25
  Top 0.35: R3.1 v65.4,27.65 | J3.6 8.95,24.5 C20.2 8.9,24.05 v8.9,23.15 | 62.5,9.25 R38.2 | U5.1 44.9,32.96 C22.2 C23.2 | C23.2 v44.9,37.05 | C23.2 v45.9,35.9 | C50.2 v30.9,24.15 | v24,24.15 C39.2 | v28.5,45.45 C35.2 | v30.05,45.45 C34.2 | C33.2 v35.4,40.45 | C36.2 34.45,38.95 v35.4,38.95 | C45.2 35.3,37.35 v35.35,37.4 | C44.2 v35.35,34.6 | v5.65,52.8 C1.2 | v1.4,52.7 C2.2 | v12,31.5 12.22,31.27 J3.10 J3.9 | J3.13 1.75,28 v0.75,28
  Top 0.406: J4.1 91.15,56.76 C40.1 91.15,53.25 v91.3,53.1 | J5.1 94.52,29.87 93.25,28.6 C46.1 v93.25,29
  Top 0.5: 29.71,8.84 30,9.13 IC5.2
  Top 0.508: C72.2 92.9,8.35 93.06,8.2 93.94,8.2 94.41,8.67 94.41,9.16 IC2.2
  Top 0.61: 29.71,8.84 28.59,8.84 28.38,9.05 C57.2
  Top 1.016: v96.45,9.4 R41.2 | v62.5,10 62.5,9.25 | R36.2 32,10.1
  Bottom 0.25: C38.2 19.7,34.05 v19.55,34.05
  Bottom 0.35: P2.4 5.9,38.95 v4.65,38.95 4.65,41.16 5.49,42 P2.1 v5.95,42.8 | v4.65,36 4.7,36 | 4.7,36 P2.7 | P2.10 4.85,33 4.7,33.15 4.7,36
  Bottom 1.016: U1.P$1 26.05,34 26.25,34.2 26.1,34.35 C24.2
  other vias: 74.85,15.64 74.85,14.64 41.55,16.04 41.55,15.04 12.4,16.74 12.4,15.74 57.8,11.4 56,11.35 56,9.35 57.05,9.35 27.25,11.3 25.45,11.25 25.45,9.25 26.5,9.25 91.75,10.7 89.95,10.65 89.95,8.65 91,8.65 19.65,32.8 26.2,32.2 23.2,30.95 20.6,31.35 24.75,37.1 19.1,46.8 21.7,46.8 22.25,48.4 24.9,48.4 26.05,50.15 28.65,50.15 29.75,49 2,10 1,11 1,10 1,9 1,8 1,7 2.25,7 2.25,6 1,6 4.9,14.25 12,4 11.25,4 41.25,3.25 40.5,3.25 74.75,3 74,3 1,18.25 1,17.25 1,16.25 1,15.25 1,14.25 1,13.25 14.5,52.75 76.75,37.75 80,37.75 80,33.5 76.75,33.5
  pour Top: 68.1,2.64 68.1,17.14 78.1,17.14 78.1,2.64
  pour Bottom (rank 2): 68.1,2.64 68.1,17.14 83.6,17.14 83.6,2.64
  pour Top: 34.8,2.54 34.8,17.54 43.8,17.54 43.8,2.54
  pour Bottom (rank 2): 34.8,2.54 34.8,17.54 50.3,17.54 50.3,2.54
  pour Top: 6.65,3.24 6.65,18.24 15.65,18.24 15.65,3.24
  pour Bottom (rank 2): 6.65,3.24 6.65,18.24 21.15,18.24 21.15,3.24
  pour Top (no thermals): 92.25,12.1 92.25,7.9 89.05,7.9 89.05,12.1
  pour Top: 27.8,12.8 27.8,8.6 24.6,8.6 24.6,12.8
  pour Top (no thermals): 58.35,12.75 58.35,8.55 55.15,8.55 55.15,12.75
  pour GND (rank 6): 100,0 0,0 0,60 100,60
  pour Bottom: 92.25,12.1 92.25,7.9 89.05,7.9 89.05,12.1
  pour Bottom: 89.05,7.9 89.05,9.7 94.95,9.7 94.95,7.7
  pour Top (no thermals): 27.8,12.8 27.8,8.6 24.6,8.6 24.6,12.8
  pour Bottom: 27.8,12.8 27.8,8.6 24.6,8.6 24.6,12.8
  pour Bottom: 24.6,8.6 24.6,10.4 30.6,10.4 30.55,8.6
  pour Bottom: 24.6,8.6 24.6,10.4 32.4,10.4 32.4,8.4 30.6,8.4 30.6,8.6
  pour Bottom: 58.35,12.75 58.35,8.55 55.15,8.55 55.15,12.75
  pour Top (no thermals): 55.15,8.55 55.15,10.35 60.75,10.35 60.75,8.55
  pour Bottom: 55.15,8.55 55.15,10.35 60.75,10.35 60.75,8.55
  pour Bottom (rank 6): 0.05,59.9 0.05,0 0.1,-0.05 99.8,-0.05 99.9,0.05 99.9,59.85 0.1,59.85
  pour 3V3: 17,40.7 24.65,40.7 26.35,42.4 26.35,43.7 30.55,47.9 30.55,50.55 27.95,53.15 12.85,53.15 4.25,44.55 4.25,32 5.75,30.5 10.5,30.5 10.6,30.6 11.9,30.6 16.45,35.15 16.45,40.15
  pour Top (no thermals): 3.5,21 3.5,5.25 0.25,5.25 0.25,21
  pour Bottom (no thermals): 3.5,21 3.5,5.25 0.25,5.25 0.25,21
  pour Top (no thermals): 4.5,14.65 6.85,14.65 7,14.5 7,11.5 5,11.5 4.5,12
  pour Bottom (no thermals): 4.5,14.7 6.8,14.7 7,14.5 7,12.5 5.5,11 4.5,12
GND1
  pour Top (rank 2, no thermals): 89.05,7.9 89.05,9.7 94.95,9.7 94.95,7.7
GND2
  pour Top (rank 2, no thermals): 24.6,8.6 24.6,10.4 30.6,10.4 30.55,8.6
LED0
  Top 0.25: R18.1 67.22,23.12 67.22,23.26 67.06,23.43 65.94,23.43 65.78,23.26 65.78,22.64 65.28,22.15 18.67,22.15 18,22.82 U1.4
LED1
  Top 0.25: R19.1 68.28,23.18 68.28,23.26 67.71,23.82 65.77,23.82 65.38,23.43 65.38,22.81 65.12,22.55 18.83,22.55 18.4,22.98 U1.5
LED2
  Top 0.25: R17.1 65.45,21.75 18.5,21.75 17.6,22.65 U1.3
LED3  (via drill 0.35)
  Top 0.25: R1.1 v68.45,28.7 69.72,29.98 74.71,29.98 77.5,32.76 77.5,48 69,56.5 52.77,56.5 J6.9 | U1.78 24,43.01 25.34,44.35 v25.75,44.35
  Bottom 0.25: v68.45,28.7 68.06,28.7 67.54,29.23 65.22,29.23 63.75,27.75 60.5,27.75 59.56,28.69 51.59,28.69 51.25,29.03 51.25,35.25 41.75,44.75
  Bottom 0.3: v25.75,44.35 25.95,44.35 26.5,44.9 27,44.9 27.15,44.75 41.75,44.75
LED4  (via drill 0.35)
  Top 0.25: v67.3,28.65 67.35,28.6 R2.1 | U1.77 24.4,42.84 25.33,43.77 26.18,43.77 26.18,43.79 26.69,44.3 v26.75,44.3 | J6.12 68.35,58.4 78,48.75 78,32.7 74.88,29.57 70.33,29.57 v70,29.25
  Bottom 0.25: v26.75,44.3 41.45,44.3 50.85,34.9 50.85,28.86 51.42,28.29 58.96,28.29 60,27.25 64,27.25 65.4,28.65 v67.3,28.65 67.55,28.65 68.07,28.12 68.88,28.12 v70,29.25
LEDD  (via drill 0.35)
  Top 0.25: J3.11 0.88,31.3 v0.8,31.3 | R44.1 66.2,34.05 65,35.25 55,35.25 v54.5,34.75
  Bottom 0.25: v0.8,31.3 0.8,45.4 10.16,54.77 33.73,54.77 53.75,34.75 v54.5,34.75
LEDD0  (via drill 0.35)
  Top 0.2: U1.43 31.49,31.8 31.51,31.77
  Top 0.25: 31.51,31.77 33.05,30.24 33.05,25.83 34.33,24.55 48.17,24.55 52.17,28.55 PWM0.1 51.83,28.93 v51.83,29.26 | v67.25,34 67.25,32.95 R45.1
  Bottom 0.25: v51.83,29.26 51.83,29.99 52.24,30.4 63.9,30.4 67.25,33.75 v67.25,34 67.25,34.25 67.5,34.5 86.25,34.5 93.46,27.29 J5.2
LEDD1  (via drill 0.35)
  Top 0.25: U1.44 31.66,32.2 33.45,30.41 33.45,26 34.5,24.95 48,24.95 51.25,28.2 51.25,30 51.8,30.55 PWM1.1 52.4,30.35 v52.4,29.75 | v68.25,33.75 68.4,33.6 R46.1
  Bottom 0.25: v68.25,33.75 64.5,30 52.65,30 v52.4,29.75
MISO
  Top 0.25: U1.52 31.51,35.4 31.54,35.38 35.88,35.38 36.25,35 36.25,29.8 MISO.1
MOSI
  Top 0.25: U1.55 32.01,36.6 32.04,36.58 36.46,36.58 38.3,34.73 MOSI.1
N$1
  Top 0.2: U1.75 25.2,42.55 25.65,43 27,43 27.4,43.4 27.4,46.4 27.86,46.85 34.6,46.85 35.1,46.35 X1.P$3 C4.1
N$2
  Top 0.2: U1.74 25.6,42.45 25.8,42.65 27.15,42.65 27.75,43.25 27.75,46.25 28,46.5 31.25,46.5 34.3,43.45 X1.P$1 35.1,41.75 36.05,40.8 C3.1
N$3
  Top 0.25: 17.18,42.52 17.2,42.49 U1.95
  Top 0.254: C1.1 5.6,50.15 X2.P$2 5.6,47.3 6.7,46.2 arc90 7.15,46.2 7.56,46.61 arc-90 8.01,46.61 8.07,46.54 arc-90 8.07,46.1 7.66,45.69 arc90 7.66,45.24 7.72,45.18 arc90 8.17,45.18 8.58,45.59 arc-90 9.02,45.59 9.09,45.53 arc-90 9.09,45.08 8.68,44.67 arc90 8.68,44.23 10,42.9 16.79,42.9 17.18,42.52
N$4
  Top 0.2: U1.96 16.8,42.36 16.7,42.45 16.05,42.45 16,42.4
  Top 0.254: C2.1 X2.P$1 1.4,46.45 2.05,45.8 4.5,45.8 5.35,45.8 8.75,42.4 16,42.4
N$5
  cutout GND: 18,42.4 22.95,42.4 22.95,40.6 18,40.6
N$6
  cutout GND: 14.65,38.7 16.25,38.7 16.25,36.1 16.2,36.05 14.55,36.05 14.65,36.15
N$7
  cutout GND: 3.05,27.1 3.1,27.15 11.5,27.15 11.5,26.05 3,26.05 3,27.05
N$8
  cutout 3V3: 5.15,41.45 6.55,41.45 6.6,41.5 6.6,33.6 5.3,33.6 5.25,33.65 5.15,33.75
N$9
  Top 0.35: D2.2 70.65,21.5 R19.2
N$10
  Top 0.35: D2.3 71.16,21.3 70.68,20.82 68.06,20.82 67.88,21.02 67.88,21.18 R18.2
N$11
  Top 0.35: D2.4 73.66,21.3 72.69,20.32 67.47,20.32 66.78,21.02 66.78,21.23 R17.2
N$12
  Top 0.35: D1.2 70.25,26.35 R1.2
N$13
  Top 0.25: U1.98 13.9,39.8 R16.1
N$14
  Top 0.35: D1.3 70.96,26.35 70.28,25.68 67.86,25.68 67.67,25.86 67.67,26.02 R2.2
N$15
  Top 0.25: R5.2 74.35,7.14 74.6,7.39 74.6,8.14 74.82,8.36 U2.6
N$16
  Top 0.25: C5.2 77.23,11.41 77.76,10.88 77.76,10.31 U2.3 78.73,10.26
  Top 0.4: L1.P$1 82.6,7.86 82.6,9.14 82.1,9.64 79.1,9.64 78.85,9.89 78.85,10.14 78.73,10.26
N$17
  Top 0.25: R7.1 R5.1 R6.2
N$18
  Top 0.25: U2.4 75.5,11.95 C5.1
N$19
  Top 0.25: R4.1 74.15,10.64 74.5,10.29 74.5,9.49 74.68,9.31 U2.5
N$20
  Top 0.25: R9.2 41.05,7.54 41.3,7.79 41.3,8.54 41.52,8.76 U3.6
N$21
  Top 0.25: C10.2 43.93,11.81 44.46,11.28 44.46,10.71 U3.3 45.43,10.66
  Top 0.4: L2.P$1 49.3,8.26 49.3,9.54 48.8,10.04 45.8,10.04 45.55,10.29 45.55,10.54 45.43,10.66
N$22
  Top 0.25: R11.1 R9.1 R10.2
N$23
  Top 0.25: U3.4 42.2,12.35 C10.1
N$24
  Top 0.35: R3.2 66.58,26.02 66.58,25.86 67.27,25.18 72.28,25.18 73.46,26.35 D1.4
N$25
  Top 0.25: R8.1 40.85,11.04 41.2,10.69 41.2,9.89 41.38,9.71 U3.5
N$26
  cutout Top: 3,26.1 3,27.1 1.15,27.1 1.15,36.25 5.15,40.25 16.15,40.25 16.25,40.15 16.25,34.65 15.8,34.65 12.9,31.75 12.9,26.95 12.75,27.1 2.95,27.1 3.05,27.1 3,27.1
N$27
  Top 0.25: R13.2 11.9,8.24 12.15,8.49 12.15,9.24 12.37,9.46 U4.6
N$28
  Top 0.25: C15.2 14.78,11.35 U4.3 16.28,11.36
  Top 0.4: L3.P$1 20.15,8.96 20.15,10.24 19.65,10.74 16.65,10.74 16.4,10.99 16.4,11.24 16.28,11.36
N$29
  Top 0.25: R15.1 R13.1 R14.2
N$30
  Top 0.25: U4.4 13.05,13.05 C15.1
N$31
  Top 0.25: R12.1 11.7,11.74 12.05,11.39 12.05,10.59 12.23,10.41 U4.5
N$32
  cutout Bottom: 17.25,40.7 24.65,40.7 26.35,42.4 26.35,43.7 30.55,47.9 30.55,50.55 27.95,53.15 12.85,53.15 5.25,45.55 5.25,31 5.75,30.5 10.5,30.5 10.6,30.6 11.9,30.6 16.45,35.15 16.45,39.9
N$33
  cutout Top: 90.05,58.85 92.55,58.85 92.55,55.35 90.05,55.35
  cutout GND: 90.05,58.85 92.55,58.85 92.55,55.35 90.05,55.35
  cutout Bottom: 90.05,58.85 92.55,58.85 92.55,55.35 90.05,55.35
  cutout Bottom: 94.5,28.5 94.5,31 98,31 98,28.5
  cutout GND: 94.5,28.5 94.5,31 98,31 98,28.5
N$35
  Top 1.016: L7.P$1 94.31,10.46 93.9,10.46 93.5,10.06 IC2.3
N$36
  Top 0.406: R41.1 96.05,7.25 IC2.5 95.4,5.3 C70.1 R40.1
N$37
  Top 0.2: U1.94 17.58,41.62 17.58,42.65 16.73,43.5 13,43.5 12.4,44.1 R42.2
N$38
  Top 0.35: R46.2 70.4,31.6 D3.2
N$39
  Top 0.35: D3.3 70.91,31.4 70.43,30.93 67.81,30.93 67.62,31.11 67.62,31.27 R45.2
N$40
  cutout Top: 17,40.75 13.25,44.5 13.25,45.75 13.25,53.75 15,55.5 34,55.5 39.75,55.5 42.25,53 47,48.25 64,48.25 65.5,46.75 65.5,41 63,38.5 62.75,38.25 45.5,38.25 43.75,38.25 35.25,46.75 30.5,46.75 24.25,40.5 17.25,40.5
N$41
  Top 0.35: D3.4 73.41,31.4 72.44,30.43 67.22,30.43 66.53,31.11 66.53,31.27 R44.2
N$45
  Top 1.016: L6.P$1 29.86,11.16 29.45,11.16 29.05,10.76 IC5.3
N$46
  Top 0.406: R36.1 31.6,7.95 IC5.5 30.95,6 C55.1 30.85,5.8 R35.1
N$48
  Top 0.25: U1.40 31.66,30.6 32.65,29.61 32.65,25.67 34.17,24.15 48.33,24.15 51.83,27.65 52.92,27.65 53.65,26.92 53.65,26.1 RX2.1
N$51
  Top 0.3: L9.P$1 60.41,11.11 60,11.11 59.6,10.71
  Top 0.5: IC6.3 59.6,10.71
N$52
  Top 0.406: R38.1 62.55,7.4 62.4,7.25 IC6.5 61.5,5.95 C59.1 61.45,5.7 R37.1
N$53
  cutout GND: 5.25,17.5 7.25,17.5 7.25,14.25 5.25,14.25
N$54  (via drill 0.35)
  Top 0.25: v29.22,30.97 29.68,30.97 29.71,31 U1.41 | v45,28.18 45.99,28.18 46.75,28.94 46.75,32.93 50.67,36.85 74.41,36.85 v76.78,39.22 | SW2.1 92.7,35.25 88.25,35.25 PB2.1 84.25,39.25 v80,39.25
  Bottom 0.25: v29.22,30.97 32.01,28.18 v45,28.18 | v76.78,39.22 79.97,39.22 v80,39.25
N$55  (via drill 0.35)
  Top 0.2: v66.75,44.5 67,44.75 C47.1 68.65,45.5 71.5,45.5 71.75,45.75 71.75,51 v70.5,52.25
  Top 0.25: R39.2 68.1,44.55 C47.1 | R32.2 v70.5,52.25
  Bottom 0.2: J6.4 57.97,43.5 65.75,43.5 v66.75,44.5
N$56
  Top 0.25: J6.5 60.73,49.75 63.83,49.75 64.62,48.95 65.86,48.95 66.66,49.75 R34.2 | R34.2 R33.2 | R34.2 68.1,48.45 C48.1 L4.2
N$57  (via drill 0.35)
  Top 0.25: U1.42 29.6,31.4 v29.25,31.75 | v45.75,28.75 46.25,29.25 46.25,33 50.5,37.25 74,37.25 v76.75,40 | v80,40 85.75,40 PB3.1
  Bottom 0.25: v29.25,31.75 32.25,28.75 v45.75,28.75 | v76.75,40 v80,40
N$58
  Top 0.25: U1.2 17.2,22.48 18.33,21.35 65.4,21.35 66.88,19.88 75.38,19.88 78.5,23 78.5,43.25 82.25,47 DIGITAL1.1 87.25,46.5 92.2,46.5 SW3.1
N$61
  Top 0.25: U1.1 16.8,22.32 18.17,20.95 65.23,20.95 66.71,19.48 75.54,19.48 78.9,22.83 78.9,42.9 80.5,44.5 DIGITAL2.1 86.75,44 89.5,41.25 91.95,41.25 SW1.1
N$62
  Top 0.2: 15.45,27.75 U1.128
  Top 0.25: 15.45,27.75 16,27.75 16.25,27.5 16.25,27.25 16.4,27.1 16.4,22.15 18,20.55 65.07,20.55 66.54,19.07 75.71,19.07 79.3,22.67 79.3,41 80.05,41.75 DIGITAL3.1
N$65
  cutout Top: 16.4,35.2 16.4,23.4 8.2,15.2 4.95,15.2 4.95,16.95 5.75,17.75 7.91,17.75 12.75,22.76 12.75,28.85 12.85,28.95 12.85,32.5 13.25,32.9 13.25,34.95 13.5,35.2
P1V2  (via drill 0.35)
  Top 0.25: 18,16.5 19.75,16.5 20,16.75 SJ6.1
  Top 0.35: R14.1 10.15,10.84 v10.15,10.9 | C19.1 17,13.64 v16.9,13.74 | C18.1 18,16.5
  Bottom 0.35: v10.15,10.9 9.65,11.4 9.65,13.24 10.4,13.99 16.65,13.99 v16.9,13.74
  pour Top (rank 2): 16.15,10.99 21.15,10.99 21.15,18.24 16.15,18.24
P1V8  (via drill 0.35)
  Top 0.25: 47.15,15.8 48.7,15.8 49.57,14.93 L2.P$2
  Top 0.35: R10.1 39.3,10.14 v39.3,10.2 | C14.1 46.15,12.94 v46.05,13.04 | C13.1 47.15,15.8
  Bottom 0.35: v39.3,10.2 38.8,10.7 38.8,12.54 39.55,13.29 45.8,13.29 v46.05,13.04
  pour Top (rank 2): 45.3,10.29 50.3,10.29 50.3,17.54 45.3,17.54
P3V3  (via drill 0.35)
  Top 0.25: 80.25,15.4 82.21,15.4 82.45,15.64 SJ4.1
  Top 0.35: R6.1 72.6,9.74 v72.6,9.8 | C9.1 79.45,12.54 v79.35,12.64 | 80.25,15.4 C8.1
  Bottom 0.35: v72.6,9.8 72.1,10.3 72.1,12.14 72.85,12.89 79.1,12.89 v79.35,12.64
  pour Top (rank 2): 78.6,9.89 83.6,9.89 83.6,17.14 78.6,17.14
PRE1V2
  Top 0.406: L6.P$2 30.5,14.3 30.6,14.2 31.8,14.2 33,13 33,5.05 32.45,4.5 R35.2 31.75,4.15 C55.2
  pour Bottom: 24.6,14 32.2,14 32.2,17 24.6,17
  pour Top: 24.6,14 32.2,14 32.2,17 24.6,17
PRE1V8
  Top 0.406: L9.P$2 61.05,14.25 61.15,14.15 62.35,14.15 63.55,12.95 63.55,4.75 63.2,4.4 R37.2 62.35,4.1 C59.2
  pour Bottom: 55.15,13.95 62.75,13.95 62.75,16.95 55.15,16.95
  pour Top: 55.15,13.95 62.75,13.95 62.75,16.95 55.15,16.95
PRE3V3
  Top 0.406: L7.P$2 94.95,13.6 95.05,13.5 96.25,13.5 97.45,12.3 97.45,4.35 96.95,3.85 R40.2 96.2,3.45 C70.2
  pour Bottom: 89.05,13.3 96.65,13.3 96.65,16.3 89.05,16.3
  pour Top: 89.05,13.3 96.65,13.3 96.65,16.3 89.05,16.3
RX0
  Top 0.2: U1.48 31.55,33.8 31.85,33.5 34.15,33.5 35.4,32.25 35.4,29.09 37.84,26.65 45.49,26.65 47.48,28.64 47.48,32.48 48.75,33.75 53.76,33.75 54,33.5 54,33.15 55.45,31.7 R29.2 57,31 57,26.9 57.15,26.75 58.78,26.75 59.25,27.22 59.25,29.5 61.21,31.46 J1.2
RX1
  Top 0.25: U1.8 19.6,25.45 18.8,24.65 18.8,23.3 19.15,22.95 50.85,22.95 RX1.1
SCK
  Top 0.25: U1.53 31.68,35.8 31.7,35.77 36.12,35.77 36.75,35.15 36.75,31.05 SCK.1
SCL  (via drill 0.35)
  Top 0.2: 52.52,31.32 52.65,31.32 v53.27,31.95 53.45,31.77 53.45,29.39 54.2,28.64 SCL0.1
  Top 0.25: U1.45 31.82,32.6 33.85,30.57 33.85,26.16 34.66,25.35 47.84,25.35 50.85,28.36 50.85,30.3 51.88,31.32 52.52,31.32 | R27.2 54.45,27.45 SCL0.1
  Bottom 0.25: P2.13 2.45,30 2,30.45 2,44.75 11.15,53.9 33.35,53.9 52.5,34.75 52.5,32.73 v53.27,31.95 55.2,31.95 59.25,36 67.75,36 86.28,54.53 J4.3
SDA  (via drill 0.35)
  Top 0.2: 51.71,31.73 52.72,32.73 v53.52,32.73 54.2,32.05 SDA0.1
  Top 0.25: U1.46 31.99,33 34.25,30.74 34.25,26.33 34.83,25.75 47.67,25.75 50.45,28.53 50.45,30.46 51.71,31.73 | R28.2 54.45,29.45 SDA0.1
  Bottom 0.25: P2.14 2.15,29 1.45,29.7 1.45,45.15 10.65,54.35 33.55,54.35 53.3,34.6 53.3,32.95 v53.52,32.73 55.02,32.73 59.29,37 67.25,37 83.7,53.45 J4.4
SDC0_CLK
  Top 0.2: J3.5 7.85,27.5 6.85,28.5 6.85,29.01 arc-90 7.14,29.3 arc90 7.42,29.59 7.42,29.65 arc90 7.14,29.94 arc-90 6.85,30.23 6.85,30.3 arc-90 7.14,30.58 arc90 7.42,30.87 7.42,30.94 arc90 7.14,31.23 arc-90 6.85,31.52 6.85,31.58 arc-90 7.14,31.87 arc90 7.42,32.16 7.42,32.23 arc90 7.14,32.51 arc-90 6.85,32.8 7.52,33.47 arc90 7.52,33.88 arc-90 7.52,34.28 7.53,34.29 arc-90 7.94,34.29 arc90 8.34,34.29 8.35,34.3 arc90 8.35,34.71 arc-90 8.35,35.11 8.36,35.12 arc-90 8.77,35.12 arc90 9.17,35.12 9.18,35.13 arc90 9.18,35.54 arc-90 9.18,35.94 9.19,35.95 arc-90 9.59,35.95 arc90 10,35.95 11.05,37 U1.105
  Top 0.25: J3.5 7.85,23.05 R26.1
SDC0_CMD
  Top 0.2: J3.3 5.65,27.39 arc-90 5.94,27.68 arc90 6.22,27.96 6.22,28.18 arc90 5.94,28.46 arc-90 5.65,28.75 5.65,28.96 arc-90 5.94,29.25 arc90 6.22,29.54 6.22,29.75 arc90 5.94,30.04 arc-90 5.65,30.32 5.65,30.54 arc-90 5.94,30.82 arc90 6.22,31.11 6.22,31.32 arc90 5.94,31.61 arc-90 5.65,31.9 5.65,33.3 5.68,33.33 arc-90 6.09,33.33 arc90 6.49,33.33 6.55,33.39 arc90 6.55,33.79 arc-90 6.55,34.2 10.15,37.8 U1.103
  Top 0.254: J3.3 5.65,25.84 4.75,24.93 R25.1
SDC0_D0
  Top 0.2: J3.7 10.05,27.65 9.7,28 arc90 9.29,28 9.12,27.83 arc-90 8.72,27.83 8.61,27.94 arc-90 8.61,28.35 8.78,28.52 arc90 8.78,28.93 8.2,29.5 8.2,30.2 arc-90 8.49,30.49 arc90 8.78,30.77 8.78,30.83 arc90 8.49,31.11 arc-90 8.2,31.4 8.2,31.45 arc-90 8.49,31.74 arc90 8.78,32.03 8.78,32.08 arc90 8.49,32.37 arc-90 8.2,32.66 8.2,33 8.45,33.25 arc-90 8.86,33.25 arc90 9.26,33.25 9.27,33.25 arc90 9.27,33.66 arc-90 9.27,34.06 9.27,34.07 arc-90 9.67,34.07 arc90 10.08,34.07 10.08,34.07 arc90 10.08,34.48 arc-90 10.08,34.88 10.09,34.88 arc-90 10.49,34.88 arc90 10.9,34.88 10.9,34.89 arc90 10.9,35.29 arc-90 10.9,35.7 10.9,35.7 arc-90 11.31,35.7 arc90 11.72,35.7 11.72,35.7 arc90 11.72,36.11 arc-90 11.72,36.52 11.8,36.6 U1.106
  Top 0.254: J3.7 10.05,25.59 10.2,25.43 R21.1
SDC0_D1
  Top 0.2: J3.8 11.15,27.6 9.2,29.55 9.2,32.6 9.68,33.08 arc-90 9.98,33.08 10.5,32.56 arc90 10.91,32.56 10.97,32.62 arc90 10.97,33.02 10.45,33.54 arc-90 10.45,33.95 10.51,34.01 arc-90 10.91,34.01 11.43,33.49 arc90 11.84,33.49 11.9,33.55 arc90 11.9,33.95 11.38,34.47 arc-90 11.38,34.88 11.44,34.94 arc-90 11.85,34.94 12.37,34.42 arc90 12.77,34.42 12.83,34.48 arc90 12.83,34.89 12.31,35.41 arc-90 12.31,35.81 12.7,36.2 U1.107
  Top 0.254: J3.8 11.15,25.59 11.75,24.98 R22.1
SDC0_D2
  Top 0.2: J3.1 3.45,33.45 8.6,38.6 U1.101
  Top 0.254: R23.1 1.5,25.39 2.7,26.59 J3.1
SDC0_D3
  Top 0.2: J3.2 4.55,29.59 arc-90 4.84,29.87 arc90 5.12,30.16 5.12,30.57 arc90 4.84,30.86 arc-90 4.55,31.15 4.55,31.54 arc-90 4.84,31.83 4.9,31.83 arc90 5.19,32.11 5.19,32.12 arc90 4.9,32.41 4.84,32.41 arc-90 4.55,32.7 4.55,33.15 9.6,38.2 U1.102
  Top 0.254: J3.2 4.55,26.3 3.1,24.85 R24.1
TX0
  Top 0.2: U1.49 31.68,34.2 32.03,33.85 34.3,33.85 35.75,32.4 35.75,29.24 37.99,27 45.34,27 47.12,28.78 47.12,32.62 48.6,34.1 53.9,34.1 54.3,33.7 R30.2 57,34.4 58.05,34.4 58.41,34.04 J1.3
TX1
  Top 0.25: U1.9 20,25.28 19.2,24.48 19.2,23.47 19.32,23.35 49.25,23.35 TX1.1
TX2
  Top 0.25: U1.39 31.49,30.2 32.25,29.44 32.25,25.5 34,23.75 48.5,23.75 52,27.25 52.75,27.25 53.25,26.75 53.25,24.5 TX2.1
USB_ID  (via drill 0.35)
  Top 0.2: P1.4 7.65,15.1 7.9,14.85 R20.2 9.35,14.85 v9.6,14.6 | U1.100 v17,39
  Bottom 0.2: v17,39 16.25,38.25 16.25,34.45 17.3,33.4 17.3,29.4 9.6,21.7 v9.6,14.6
USBDIFF_N
  Top 0.15: U1.110 15.35,34.95 14.34,34.95 13.75,34.36 13.75,22.06 7.94,16.25 7.4,16.25 7.25,16.4 P1.2
USBDIFF_P
  Top 0.15: U1.111 15.35,34.65 14.46,34.65 14.05,34.24 14.05,21.94 8.06,15.95 7.4,15.95 7.2,15.75 P1.3
VCC  (via drill 0.35)
  Top 0.25: R8.2 38.45,11.79 38.95,12.29 v39.55,12.29 | v45.55,7.79 45.55,8.6 45.39,8.76 U3.1 | R12.2 9.3,12.49 9.8,12.99 v10.4,12.99 | v16.4,8.49 16.4,9.3 16.24,9.46 U4.1 | R4.2 71.75,11.39 72.25,11.89 v72.85,11.89 | v78.85,7.39 78.85,8.2 78.69,8.36 U2.1
  Top 0.406: C16.1 16.25,8.34 v16.4,8.49 | C11.1 45.4,7.64 v45.55,7.79 | C6.1 78.7,7.24 v78.85,7.39 | IC2.4 93.45,6.55 v93.45,5.5 94,4.95 94,1 | v29,6.2 29,7.25 IC5.4 | J5.3 94.94,24.71 C46.2 | IC6.1 61.5,8.75 60,7.25 IC6.4
  Top 0.508: 5.25,17.05 P1.1
  Top 0.6: 4.55,17.05 3.9,16.4 3.9,11.85
  Top 0.61: C17.1 17.43,6.31 C16.1 | C12.1 46.58,5.61 C11.1 | C7.1 79.88,5.21 C6.1 | 4.55,17.05 5.25,17.05 | 3.9,11.85 5,10.75 C21.1 5V.P$1
  Top 1.016: C17.1 17.43,1.82 17.5,1.75 | C57.1 27.8,1.3 | C12.1 46.75,3.13 46.75,1 | C7.1 79.88,1.87 | C72.1 92.25,1.25 | 98.75,1.5 98.75,20 96.62,22.12 94.88,22.12 93.25,23.75 C46.2 | C61.1 58.35,1.35
  Bottom 0.25: v39.55,12.29 44.05,7.79 v45.55,7.79 | v10.4,12.99 14.9,8.49 v16.4,8.49 | v72.85,11.89 77.35,7.39 v78.85,7.39
  Bottom 0.406: IC2.1 95.4,8.05 93.45,6.1 v93.45,5.5 | IC5.1 30.95,8.75 29,6.8 v29,6.2
  other vias: 95.4,9.2 30.95,9.9
  pour Top: 24.6,7.8 29.8,7.8 29.8,3.6 24.6,3.6
  pour Top: 55.15,7.75 60.35,7.75 60.35,3.55 55.15,3.55
  pour Top: 89.05,7.1 94.25,7.1 94.25,2.9 89.05,2.9
  pour Bottom: 89.05,7.1 94.25,7.1 94.25,2.9 89.05,2.9
  pour Top: 24.6,7.8 29.8,7.8 29.8,3.6 24.6,3.6
  pour Bottom: 24.6,7.8 29.8,7.8 29.8,3.6 24.6,3.6
  pour Bottom: 55.15,7.75 60.35,7.75 60.35,3.55 55.15,3.55
  pour Top: 100,0 4.25,0 4.25,10.5 6.25,10.5 6.25,2.25 100,2.25
VIN
  pour Top (rank 2): 78.6,2.14 83.6,2.14 83.6,9.39 78.6,9.39
  pour Top (rank 2): 45.3,2.54 50.3,2.54 50.3,9.79 45.3,9.79
  pour Top (rank 2): 16.15,3.24 21.15,3.24 21.15,10.49 16.15,10.49

## Text on the board
tNames: GND / RX / TX